# EAGLE schematic 001000-005 (EAGLE 9.5.0), part 1 of 2

## Sheet 1 of 6
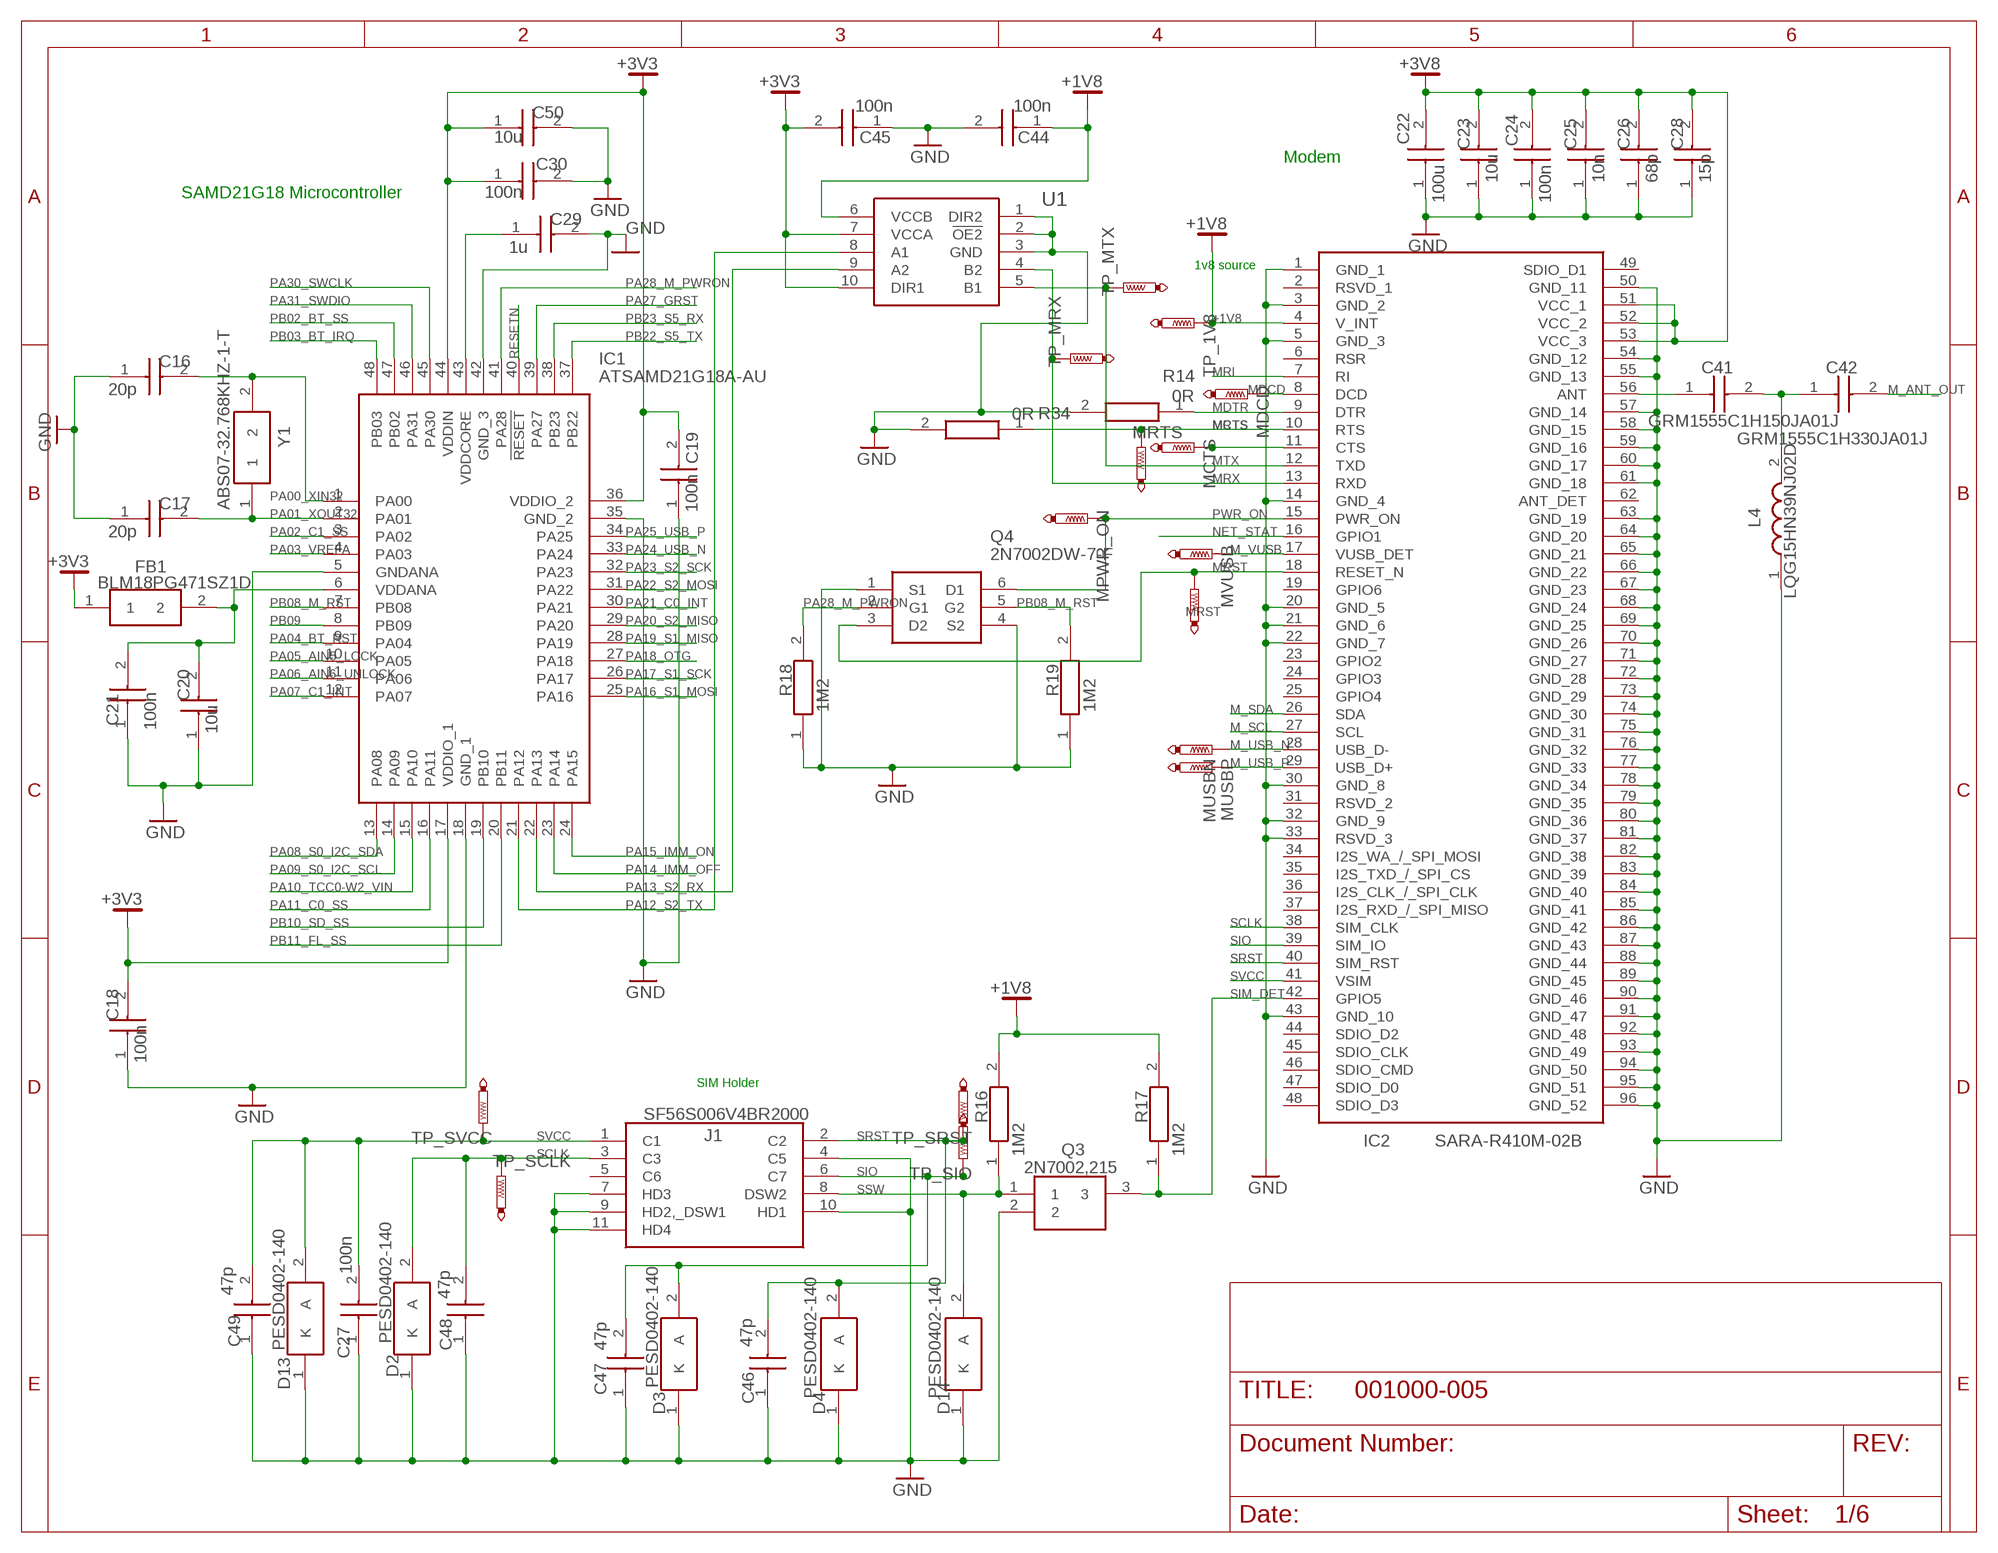
[diagram p0: schematic, sheet 1]

### Parts
C16  20p  GJM1555C1H200GB01D  [CAPC1005X55N]
C17  20p  GJM1555C1H200GB01D  [CAPC1005X55N]
C18  100n  GCM155R71C104KA55J  [CAPC1005X55N]
C19  100n  GCM155R71C104KA55J  [CAPC1005X55N]
C20  10u  GRM188R60J106KE47D  [CAPC1608X90N]
C21  100n  GCM155R71C104KA55J  [CAPC1005X55N]
C22  100u  GRM31CD80J107ME39K  [CAPC3216X180N]
C23  10u  GRM188R60J106KE47D  [CAPC1608X90N]
C24  100n  GCM155R71C104KA55J  [CAPC1005X55N]
C25  10n  GCM155R71H103KA55D  [CAPC1005X55N]
C26  68p  GCM1555C1H680JA16D  [CAPC1005X55N]
C27  100n  GCM155R71C104KA55J  [CAPC1005X55N]
C28  15p  GCM1555C1H150JA16D  [CAPC1005X55N]
C29  1u  GRM155R61C105MA12D  [CAPC1005X55N]
C30  100n  GCM155R71C104KA55J  [CAPC1005X55N]
C41  GRM1555C1H150JA01J  [CAPC1005X55N]
C42  GRM1555C1H330JA01J  [CAPC1005X55N]
C44  100n  GCM155R71C104KA55J  [CAPC1005X55N]
C45  100n  GCM155R71C104KA55J  [CAPC1005X55N]
C46  47p  GRM1555C1H470JA01D  [CAPC1005X55N]
C47  47p  GRM1555C1H470JA01D  [CAPC1005X55N]
C48  47p  GRM1555C1H470JA01D  [CAPC1005X55N]
C49  47p  GRM1555C1H470JA01D  [CAPC1005X55N]
C50  10u  GRM188R60J106KE47D  [CAPC1608X90N]
D2  PESD0402-140  [DIONC1005X43N]
D3  PESD0402-140  [DIONC1005X43N]
D4  PESD0402-140  [DIONC1005X43N]
D13  PESD0402-140  [DIONC1005X43N]
D14  PESD0402-140  [DIONC1005X43N]
FB1  BLM18PG471SZ1D  [BEADC1608X95N]
IC1  ATSAMD21G18A-AU  [QFP50P900X900X120-48N]
IC2  SARA-R410M-02B  [SARA-U201-03B]
J1  SF56S006V4BR2000  [SF56S006V4BR2000]
L4  LQG15HN39NJ02D  [INDC1005X55N]
MCTS  PTR1TP06R  [TP06R]
MDCD  PTR1TP06R  [TP06R]
MPWR_ON  PTR1TP06R  [TP06R]
MRST  PTR1TP06R  [TP06R]
MRTS  PTR1TP06R  [TP06R]
MUSBN  PTR1TP06R  [TP06R]
MUSBP  PTR1TP06R  [TP06R]
MVUSB  PTR1TP06R  [TP06R]
Q3  2N7002,215  [SOT95P230X110-3N]
Q4  2N7002DW-7-F  [SOT65P210X100-6N]
R14  0R  RMCF0402ZT0R00  [RESC1005X40N]
R16  1M2  CRCW04021M20FKED  [RESC1005X40N]
R17  1M2  CRCW04021M20FKED  [RESC1005X40N]
R18  1M2  CRCW04021M20FKED  [RESC1005X40N]
R19  1M2  CRCW04021M20FKED  [RESC1005X40N]
R34  0R  RMCF0402ZT0R00  [RESC1005X40N]
TP_1V8  PTR1TP06R  [TP06R]
TP_MRX  PTR1TP06R  [TP06R]
TP_MTX  PTR1TP06R  [TP06R]
TP_SCLK  PTR1TP06R  [TP06R]
TP_SIO  PTR1TP06R  [TP06R]
TP_SRST  PTR1TP06R  [TP06R]
TP_SVCC  PTR1TP06R  [TP06R]
U1  SN74AVC2T245RSWR  [RSW(RPUQFNN10)]
Y1  ABS07-32.768KHZ-1-T  [ABS0716632768KHZT]

### Nets
+1V8 [pwr/gnd]: C44.1 IC2.4(V_INT) R16.2 R17.2 TP_1V8.TP U1.6(VCCB)
+3V3 [pwr/gnd]: C18.2 C19.2 C30.1 C45.2 C50.1 FB1.1 IC1.17(VDDIO_1) IC1.36(VDDIO_2) IC1.44(VDDIN) U1.7(VCCA) U1.10(DIR1) ; also sheet 2,3,4,5,6
+3V8 [pwr/gnd]: C22.2 C23.2 C24.2 C25.2 C26.2 C28.2 IC2.51(VCC_1) IC2.52(VCC_2) IC2.53(VCC_3) ; also sheet 2,5
GND [pwr/gnd]: C16.1 C17.1 C18.1 C19.1 C20.1 C21.1 C22.1 C23.1 C24.1 C25.1 C26.1 C27.1 C28.1 C29.2 C30.2 C44.2 C45.1 C46.1 C47.1 C48.1 C49.1 C50.2 D2.1(K) D3.1(K) D4.1(K) D13.1(K) D14.1(K) IC1.5(GNDANA) IC1.18(GND_1) IC1.35(GND_2) IC1.42(GND_3) IC2.1(GND_1) IC2.3(GND_2) IC2.5(GND_3) IC2.14(GND_4) IC2.20(GND_5) IC2.21(GND_6) IC2.22(GND_7) IC2.30(GND_8) IC2.32(GND_9) IC2.33(RSVD_3) IC2.43(GND_10) IC2.50(GND_11) IC2.54(GND_12) IC2.55(GND_13) IC2.57(GND_14) IC2.58(GND_15) IC2.59(GND_16) IC2.60(GND_17) IC2.61(GND_18) IC2.63(GND_19) IC2.64(GND_20) IC2.65(GND_21) IC2.66(GND_22) IC2.67(GND_23) IC2.68(GND_24) IC2.69(GND_25) IC2.70(GND_26) IC2.71(GND_27) IC2.72(GND_28) IC2.73(GND_29) IC2.74(GND_30) IC2.75(GND_31) IC2.76(GND_32) IC2.77(GND_33) IC2.78(GND_34) IC2.79(GND_35) IC2.80(GND_36) IC2.81(GND_37) IC2.82(GND_38) IC2.83(GND_39) IC2.84(GND_40) IC2.85(GND_41) IC2.86(GND_42) IC2.87(GND_43) IC2.88(GND_44) IC2.89(GND_45) IC2.90(GND_46) IC2.91(GND_47) IC2.92(GND_48) IC2.93(GND_49) IC2.94(GND_50) IC2.95(GND_51) IC2.96(GND_52) J1.4(C5) J1.7(HD3) J1.9(HD2,_DSW1) J1.10(HD1) J1.11(HD4) L4.1 Q3.2 Q4.1(S1) Q4.4(S2) R14.2 R18.1 R19.1 R34.2 U1.1(DIR2) U1.2(!OE2) U1.3(GND) ; also sheet 2,3,4,5,6
M_ANT_OUT [ant_wide]: C42.2 ; also sheet 6
M_SCL [signal]: IC2.27(SCL) ; also sheet 5
M_SDA [signal]: IC2.26(SDA) ; also sheet 5
M_USB_N [signal]: IC2.28(USB_D-) MUSBN.TP
M_USB_P [signal]: IC2.29(USB_D+) MUSBP.TP
M_VUSB [signal]: IC2.17(VUSB_DET) MVUSB.TP
MCTS: IC2.11(CTS) MCTS.TP
MDCD: IC2.8(DCD) MDCD.TP
MDTR [signal]: IC2.9(DTR) R14.1
MRI [signal]: IC2.7(RI)
MRST [signal]: IC2.18(RESET_N) MRST.TP Q4.3(D2)
MRTS: IC2.10(RTS) MRTS.TP R34.1
MRX [signal]: IC2.13(RXD) TP_MRX.TP U1.4(B2)
MTX [signal]: IC2.12(TXD) TP_MTX.TP U1.5(B1)
N$1: C20.2 C21.2 FB1.2 IC1.6(VDDANA)
N$2: C41.1 IC2.56(ANT)
N$26: C29.1 IC1.43(VDDCORE)
N$43: C41.2 C42.1 L4.2
NET_STAT: IC2.16(GPIO1) ; also sheet 5
PA00_XIN32 [signal]: C16.2 IC1.1(PA00) Y1.2
PA01_XOUT32 [signal]: C17.2 IC1.2(PA01) Y1.1
PA02_C1_SS [signal]: IC1.3(PA02) ; also sheet 4
PA03_VREFA [signal]: IC1.4(PA03)
PA04_BT_RST [signal]: IC1.9(PA04) ; also sheet 3
PA05_AIN5_LOCK [signal]: IC1.10(PA05) ; also sheet 3
PA06_AIN6_UNLOCK [signal]: IC1.11(PA06) ; also sheet 3
PA07_C1_INT [signal]: IC1.12(PA07) ; also sheet 4
PA08_S0_I2C_SDA [signal]: IC1.13(PA08) ; also sheet 3,5
PA09_S0_I2C_SCL [signal]: IC1.14(PA09) ; also sheet 3,5
PA10_TCC0-W2_VIN [signal]: IC1.15(PA10) ; also sheet 3
PA11_C0_SS [signal]: IC1.16(PA11) ; also sheet 4
PA12_S2_TX [signal]: IC1.21(PA12) U1.8(A1)
PA13_S2_RX [signal]: IC1.22(PA13) U1.9(A2)
PA14_IMM_OFF [signal]: IC1.23(PA14) ; also sheet 3
PA15_IMM_ON [signal]: IC1.24(PA15) ; also sheet 3
PA16_S1_MOSI [signal]: IC1.25(PA16) ; also sheet 3,4
PA17_S1_SCK [signal]: IC1.26(PA17) ; also sheet 3,4
PA18_OTG [signal]: IC1.27(PA18) ; also sheet 6
PA19_S1_MISO [signal]: IC1.28(PA19) ; also sheet 3,4
PA20_S2_MISO [signal]: IC1.29(PA20) ; also sheet 3
PA21_C0_INT [signal]: IC1.30(PA21) ; also sheet 4
PA22_S2_MOSI [signal]: IC1.31(PA22) ; also sheet 3
PA23_S2_SCK [signal]: IC1.32(PA23) ; also sheet 3
PA24_USB_N [signal]: IC1.33(PA24) ; also sheet 6
PA25_USB_P [signal]: IC1.34(PA25) ; also sheet 6
PA27_GRST [signal]: IC1.39(PA27) ; also sheet 5
PA28_M_PWRON [signal]: IC1.41(PA28) Q4.2(G1) R18.2
PA30_SWCLK [signal]: IC1.45(PA30) ; also sheet 6
PA31_SWDIO [signal]: IC1.46(PA31) ; also sheet 6
PB02_BT_SS [signal]: IC1.47(PB02) ; also sheet 3
PB03_BT_IRQ [signal]: IC1.48(PB03) ; also sheet 3
PB08_M_RST [signal]: IC1.7(PB08) Q4.5(G2) R19.2
PB09 [signal]: IC1.8(PB09) ; also sheet 5
PB10_SD_SS [signal]: IC1.19(PB10) ; also sheet 3
PB11_FL_SS [signal]: IC1.20(PB11) ; also sheet 3
PB22_S5_TX [signal]: IC1.37(PB22) ; also sheet 5
PB23_S5_RX [signal]: IC1.38(PB23) ; also sheet 5
PWR_ON: IC2.15(PWR_ON) MPWR_ON.TP Q4.6(D1)
RESETN: IC1.40(!RESET) ; also sheet 6
SCLK [signal]: C48.2 D2.2(A) IC2.38(SIM_CLK) J1.3(C3) TP_SCLK.TP
SIM_DET [signal]: IC2.42(GPIO5) Q3.3 R17.1
SIO [signal]: C47.2 D3.2(A) IC2.39(SIM_IO) J1.6(C7) TP_SIO.TP
SRST [signal]: C46.2 D4.2(A) IC2.40(SIM_RST) J1.2(C2) TP_SRST.TP
SSW [signal]: D14.2(A) J1.8(DSW2) Q3.1 R16.1
SVCC [signal]: C27.2 C49.2 D13.2(A) IC2.41(VSIM) J1.1(C1) TP_SVCC.TP
Unconnected: IC2.2(RSVD_1) IC2.6(RSR) IC2.19(GPIO6) IC2.23(GPIO2) IC2.24(GPIO3) IC2.25(GPIO4) IC2.31(RSVD_2) IC2.34(I2S_WA_/_SPI_MOSI) IC2.35(I2S_TXD_/_SPI_CS) IC2.36(I2S_CLK_/_SPI_CLK) IC2.37(I2S_RXD_/_SPI_MISO) IC2.44(SDIO_D2) IC2.45(SDIO_CLK) IC2.46(SDIO_CMD) IC2.47(SDIO_D0) IC2.48(SDIO_D3) IC2.49(SDIO_D1) IC2.62(ANT_DET) J1.5(C6)

### Notes on the sheet
- Modem
- SAMD21G18 Microcontroller
- 1v8 source
- SIM Holder

## Sheet 2 of 6
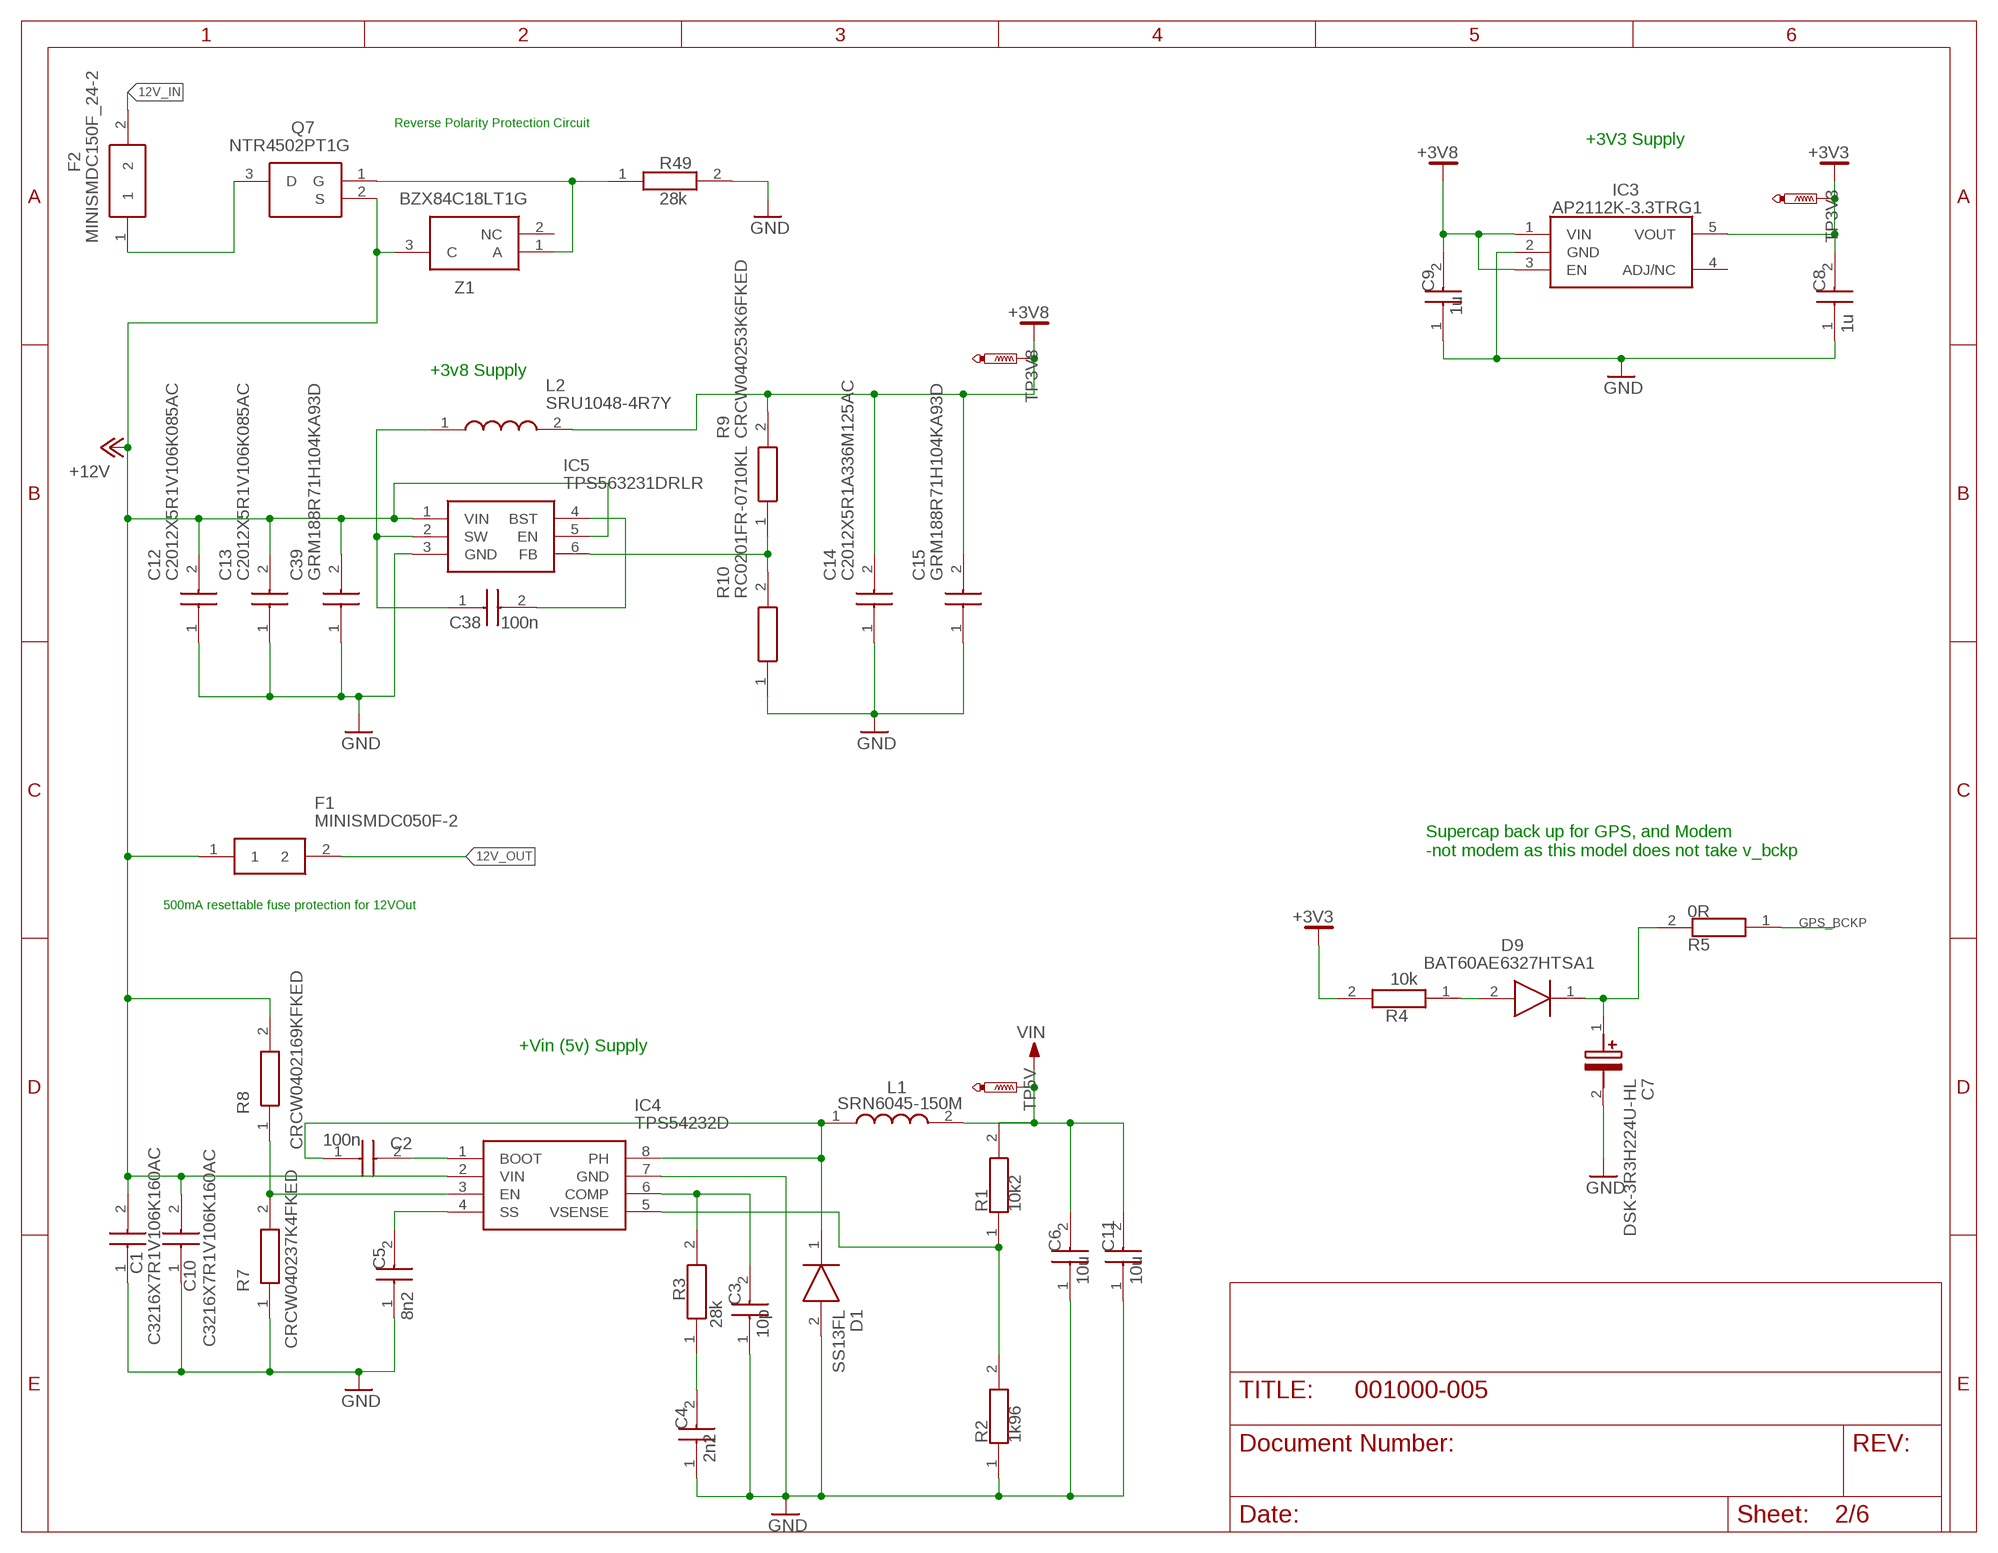
[diagram p1: schematic, sheet 2]

### Parts
C1  C3216X7R1V106K160AC  [CAPC3216X180N]
C2  100n  GCM155R71C104KA55J  [CAPC1005X55N]
C3  10p  GCM1555C1H100JA16D  [CAPC1005X55N]
C4  2n2  GRM155R71H222KA01D  [CAPC1005X55N]
C5  8n2  GRM155R71C822KA01D  [CAPC1005X55N]
C6  10u  GRM21BC81C106KE15L  [CAPC2012X145N]
C7  DSK-3R3H224U-HL  [DSK-414_HL]
C8  1u  GRM155R61C105MA12D  [CAPC1005X55N]
C9  1u  GRM155R61C105MA12D  [CAPC1005X55N]
C10  C3216X7R1V106K160AC  [CAPC3216X180N]
C11  10u  GRM21BC81C106KE15L  [CAPC2012X145N]
C12  C2012X5R1V106K085AC  [CAPC2012X100N]
C13  C2012X5R1V106K085AC  [CAPC2012X100N]
C14  C2012X5R1A336M125AC  [CAPC2012X145N]
C15  GRM188R71H104KA93D  [CAPC1608X90N]
C38  100n  GCM155R71C104KA55J  [CAPC1005X55N]
C39  GRM188R71H104KA93D  [CAPC1608X90N]
D1  SS13FL  [SODFL3617X108N]
D9  BAT60AE6327HTSA1  [SOD2513X110N]
F1  MINISMDC050F-2  [FUSC4632X62N]
F2  MINISMDC150F_24-2  [FUSC4632X194N]
IC3  AP2112K-3.3TRG1  [SOT95P282X130-5N]
IC4  TPS54232D  [SOIC127P600X175-8N]
IC5  TPS563231DRLR  [SOTFL50P160X60-6N]
L1  SRN6045-150M  [SRN6045_1]
L2  SRU1048-4R7Y  [SRU10484R7Y]
Q7  NTR4502PT1G  [SOT96P237X111-3N]
R1  10k2  CRCW040210K2FKED  [RESC1005X40N]
R2  1k96  CRCW04021K96FKED  [RESC1005X40N]
R3  28k  CRCW040228K0FKED  [RESC1005X40N]
R4  10k  RNCP0603FTD10K0  [RESC1508X50N]
R5  0R  RMCF0402ZT0R00  [RESC1005X40N]
R7  CRCW040237K4FKED  [RESC1005X40N]
R8  CRCW0402169KFKED  [RESC1005X40N]
R9  CRCW040253K6FKED  [RESC1005X40N]
R10  RC0201FR-0710KL  [RESC0603X26N]
R49  28k  CRCW040228K0FKED  [RESC1005X40N]
TP3V3  PTR1TP06R  [TP06R]
TP3V8  PTR1TP06R  [TP06R]
TP5V  PTR1TP06R  [TP06R]
Z1  BZX84C18LT1G  [SOT95P237X111-3N]

### Nets
12V_IN: F2.2 ; also sheet 6
12V_OUT: F1.2 ; also sheet 6
+3V3 [pwr/gnd]: C8.2 IC3.5(VOUT) R4.2 TP3V3.TP ; also sheet 1,3,4,5,6
+3V8 [pwr/gnd]: C9.2 C14.2 C15.2 IC3.1(VIN) IC3.3(EN) L2.2 R9.2 TP3V8.TP ; also sheet 1,5
+12V: C1.2 C10.2 C12.2 C13.2 C39.2 F1.1 IC4.2(VIN) IC5.1(VIN) IC5.5(EN) Q7.2(S) R8.2 Z1.3(C) ; also sheet 3
GND [pwr/gnd]: C1.1 C3.1 C4.1 C5.1 C6.1 C7.2(+) C8.1 C9.1 C10.1 C11.1 C12.1 C13.1 C14.1 C15.1 C39.1 D1.2(A) IC3.2(GND) IC4.7(GND) IC5.3(GND) R2.1 R7.1 R10.1 R49.2 ; also sheet 1,3,4,5,6
GPS_BCKP: R5.1 ; also sheet 5
N$5: C2.2 IC4.1(BOOT)
N$6: C2.1 D1.1(K) IC4.8(PH) L1.1
N$7: C3.2 IC4.6(COMP) R3.2
N$8: C4.2 R3.1
N$9: IC4.5(VSENSE) R1.1 R2.2
N$10: D9.2(A) R4.1
N$11: C5.2 IC4.4(SS)
N$12: C7.1(-) D9.1(K) R5.2
N$13: IC4.3(EN) R7.2 R8.1
N$16: C38.1 IC5.2(SW) L2.1
N$18: IC5.6(FB) R9.1 R10.2
N$20: C38.2 IC5.4(BST)
N$25: F2.1 Q7.3(D)
N$31: Q7.1(G) R49.1 Z1.1(A)
VIN: C6.2 C11.2 L1.2 R1.2 TP5V.TP ; also sheet 4
Unconnected: IC3.4(ADJ/NC) Z1.2(NC)

### Notes on the sheet
- Reverse Polarity Protection Circuit
- +3V3 Supply
- +3v8 Supply
- Supercap back up for GPS, and Modem
  -not modem as this model does not take v_bckp
- 500mA resettable fuse protection for 12VOut
- +Vin (5v) Supply

## Sheet 3 of 6
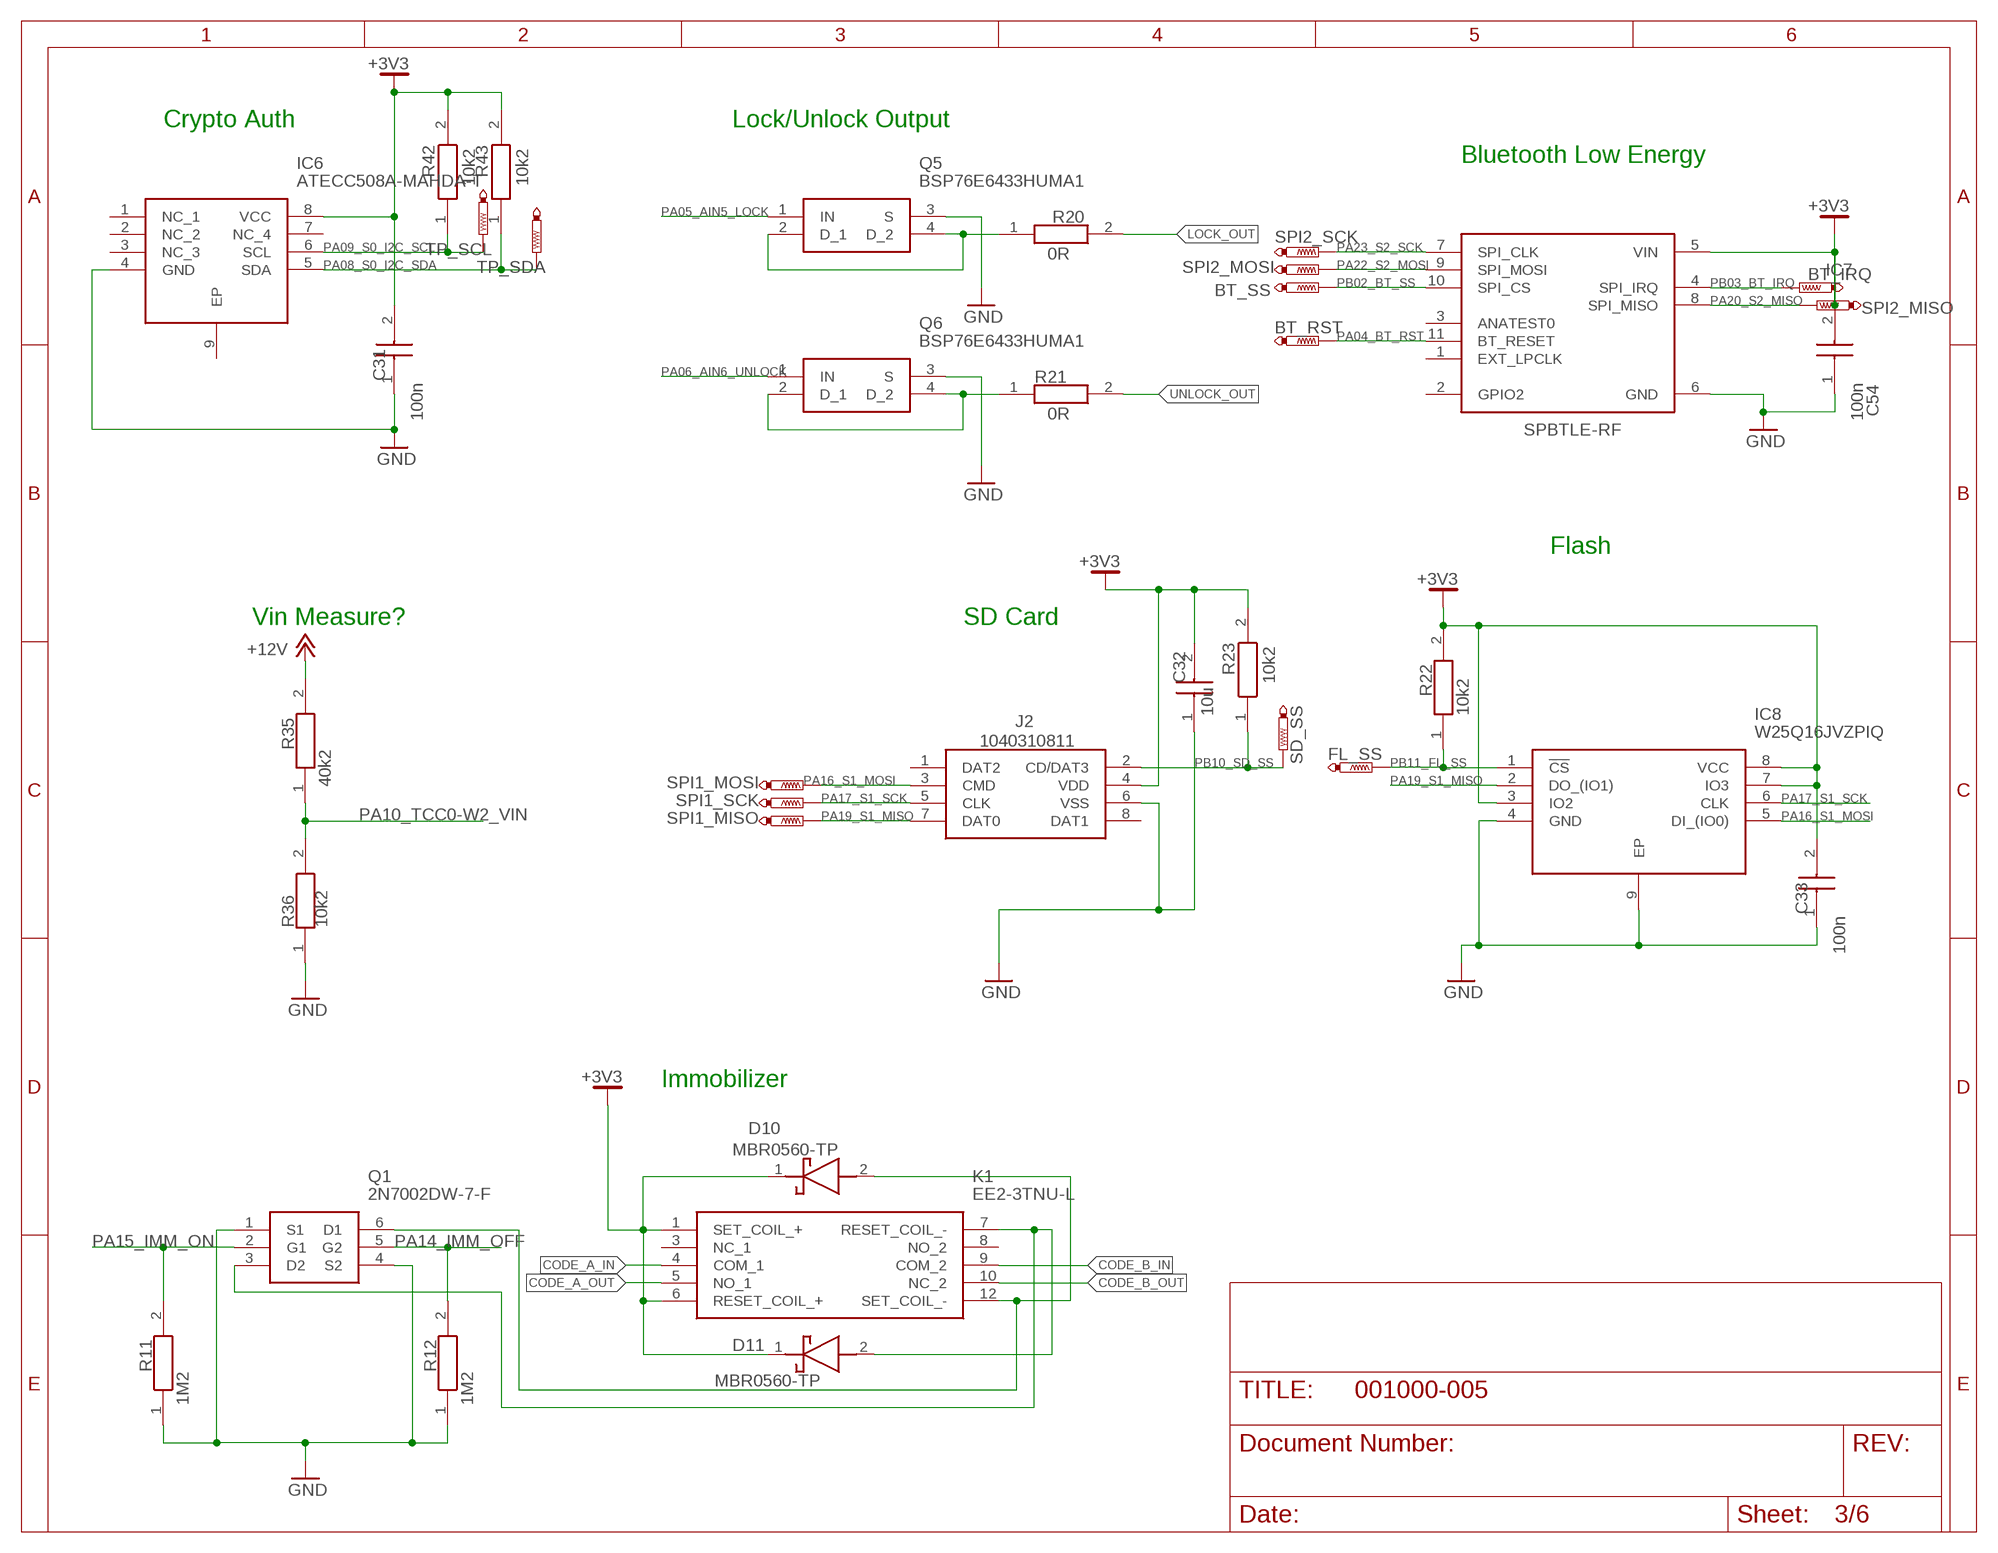
[diagram p2: schematic, sheet 3]

### Parts
BT_IRQ  PTR1TP06R  [TP06R]
BT_RST  PTR1TP06R  [TP06R]
BT_SS  PTR1TP06R  [TP06R]
C31  100n  GCM155R71C104KA55J  [CAPC1005X55N]
C32  10u  GRM155C80J106ME11D  [CAPC1005X55N]
C33  100n  GCM155R71C104KA55J  [CAPC1005X55N]
C54  100n  GCM155R71C104KA55J  [CAPC1005X55N]
D10  MBR0560-TP  [SOD3716X135N]
D11  MBR0560-TP  [SOD3716X135N]
FL_SS  PTR1TP06R  [TP06R]
IC6  ATECC508A-MAHDA-T  [SON50P300X200X60-9N]
IC7  SPBTLE-RF  [XCVR_SPBTLE-RF]
IC8  W25Q16JVZPIQ  [SON127P600X500X80-9N]
J2  1040310811  [1040310811]
K1  EE2-3TNU-L  [EE25TNU]
Q1  2N7002DW-7-F  [SOT65P210X100-6N]
Q5  BSP76E6433HUMA1  [SOT230P700X170-4N]
Q6  BSP76E6433HUMA1  [SOT230P700X170-4N]
R11  1M2  CRCW04021M20FKED  [RESC1005X40N]
R12  1M2  CRCW04021M20FKED  [RESC1005X40N]
R20  0R  CRG1206ZR  [RESC3116X65N]
R21  0R  CRG1206ZR  [RESC3116X65N]
R22  10k2  CRCW040210K2FKED  [RESC1005X40N]
R23  10k2  CRCW040210K2FKED  [RESC1005X40N]
R35  40k2  CRCW040240K2FKED  [RESC1005X40N]
R36  10k2  CRCW040210K2FKED  [RESC1005X40N]
R42  10k2  CRCW040210K2FKED  [RESC1005X40N]
R43  10k2  CRCW040210K2FKED  [RESC1005X40N]
SD_SS  PTR1TP06R  [TP06R]
SPI1_MISO  PTR1TP06R  [TP06R]
SPI1_MOSI  PTR1TP06R  [TP06R]
SPI1_SCK  PTR1TP06R  [TP06R]
SPI2_MISO  PTR1TP06R  [TP06R]
SPI2_MOSI  PTR1TP06R  [TP06R]
SPI2_SCK  PTR1TP06R  [TP06R]
TP_SCL  PTR1TP06R  [TP06R]
TP_SDA  PTR1TP06R  [TP06R]

### Nets
+3V3 [pwr/gnd]: C31.2 C32.2 C33.2 C54.2 D10.1(K) D11.1(K) IC6.8(VCC) IC7.5(VIN) IC8.3(IO2) IC8.7(IO3) IC8.8(VCC) J2.4(VDD) K1.1(SET_COIL_+) K1.6(RESET_COIL_+) R22.2 R23.2 R42.2 R43.2 ; also sheet 1,2,4,5,6
+12V: R35.2 ; also sheet 2
CODE_A_IN [signal]: K1.4(COM_1) ; also sheet 6
CODE_A_OUT [signal]: K1.5(NO_1) ; also sheet 6
CODE_B_IN [signal]: K1.9(COM_2) ; also sheet 6
CODE_B_OUT [signal]: K1.10(NC_2) ; also sheet 6
GND [pwr/gnd]: C31.1 C32.1 C33.1 C54.1 IC6.4(GND) IC7.6(GND) IC8.4(GND) IC8.9(EP) J2.6(VSS) Q1.1(S1) Q1.4(S2) Q5.3(S) Q6.3(S) R11.1 R12.1 R36.1 ; also sheet 1,2,4,5,6
LOCK_OUT: R20.2 ; also sheet 6
N$15: D11.2(A) K1.7(RESET_COIL_-) Q1.3(D2)
N$19: D10.2(A) K1.12(SET_COIL_-) Q1.6(D1)
N$28: Q6.2(D_1) Q6.4(D_2) R21.1
N$29: Q5.2(D_1) Q5.4(D_2) R20.1
PA04_BT_RST [signal]: BT_RST.TP IC7.11(BT_RESET) ; also sheet 1
PA05_AIN5_LOCK [signal]: Q5.1(IN) ; also sheet 1
PA06_AIN6_UNLOCK [signal]: Q6.1(IN) ; also sheet 1
PA08_S0_I2C_SDA [signal]: IC6.5(SDA) R43.1 TP_SDA.TP ; also sheet 1,5
PA09_S0_I2C_SCL [signal]: IC6.6(SCL) R42.1 TP_SCL.TP ; also sheet 1,5
PA10_TCC0-W2_VIN [signal]: R35.1 R36.2 ; also sheet 1
PA14_IMM_OFF [signal]: Q1.5(G2) R12.2 ; also sheet 1
PA15_IMM_ON [signal]: Q1.2(G1) R11.2 ; also sheet 1
PA16_S1_MOSI [signal]: IC8.5(DI_(IO0)) J2.3(CMD) SPI1_MOSI.TP ; also sheet 1,4
PA17_S1_SCK [signal]: IC8.6(CLK) J2.5(CLK) SPI1_SCK.TP ; also sheet 1,4
PA19_S1_MISO [signal]: IC8.2(DO_(IO1)) J2.7(DAT0) SPI1_MISO.TP ; also sheet 1,4
PA20_S2_MISO [signal]: IC7.8(SPI_MISO) SPI2_MISO.TP ; also sheet 1
PA22_S2_MOSI [signal]: IC7.9(SPI_MOSI) SPI2_MOSI.TP ; also sheet 1
PA23_S2_SCK [signal]: IC7.7(SPI_CLK) SPI2_SCK.TP ; also sheet 1
PB02_BT_SS [signal]: BT_SS.TP IC7.10(SPI_CS) ; also sheet 1
PB03_BT_IRQ [signal]: BT_IRQ.TP IC7.4(SPI_IRQ) ; also sheet 1
PB10_SD_SS [signal]: J2.2(CD/DAT3) R23.1 SD_SS.TP ; also sheet 1
PB11_FL_SS [signal]: FL_SS.TP IC8.1(!CS) R22.1 ; also sheet 1
UNLOCK_OUT: R21.2 ; also sheet 6
Unconnected: IC6.1(NC_1) IC6.2(NC_2) IC6.3(NC_3) IC6.7(NC_4) IC6.9(EP) IC7.1(EXT_LPCLK) IC7.2(GPIO2) IC7.3(ANATEST0) J2.1(DAT2) J2.8(DAT1) K1.3(NC_1) K1.8(NO_2)

### Notes on the sheet
- Crypto Auth | Lock/Unlock Output
- Bluetooth Low Energy
- Flash
- Vin Measure? | SD Card
- Immobilizer

## Sheet 4 of 6
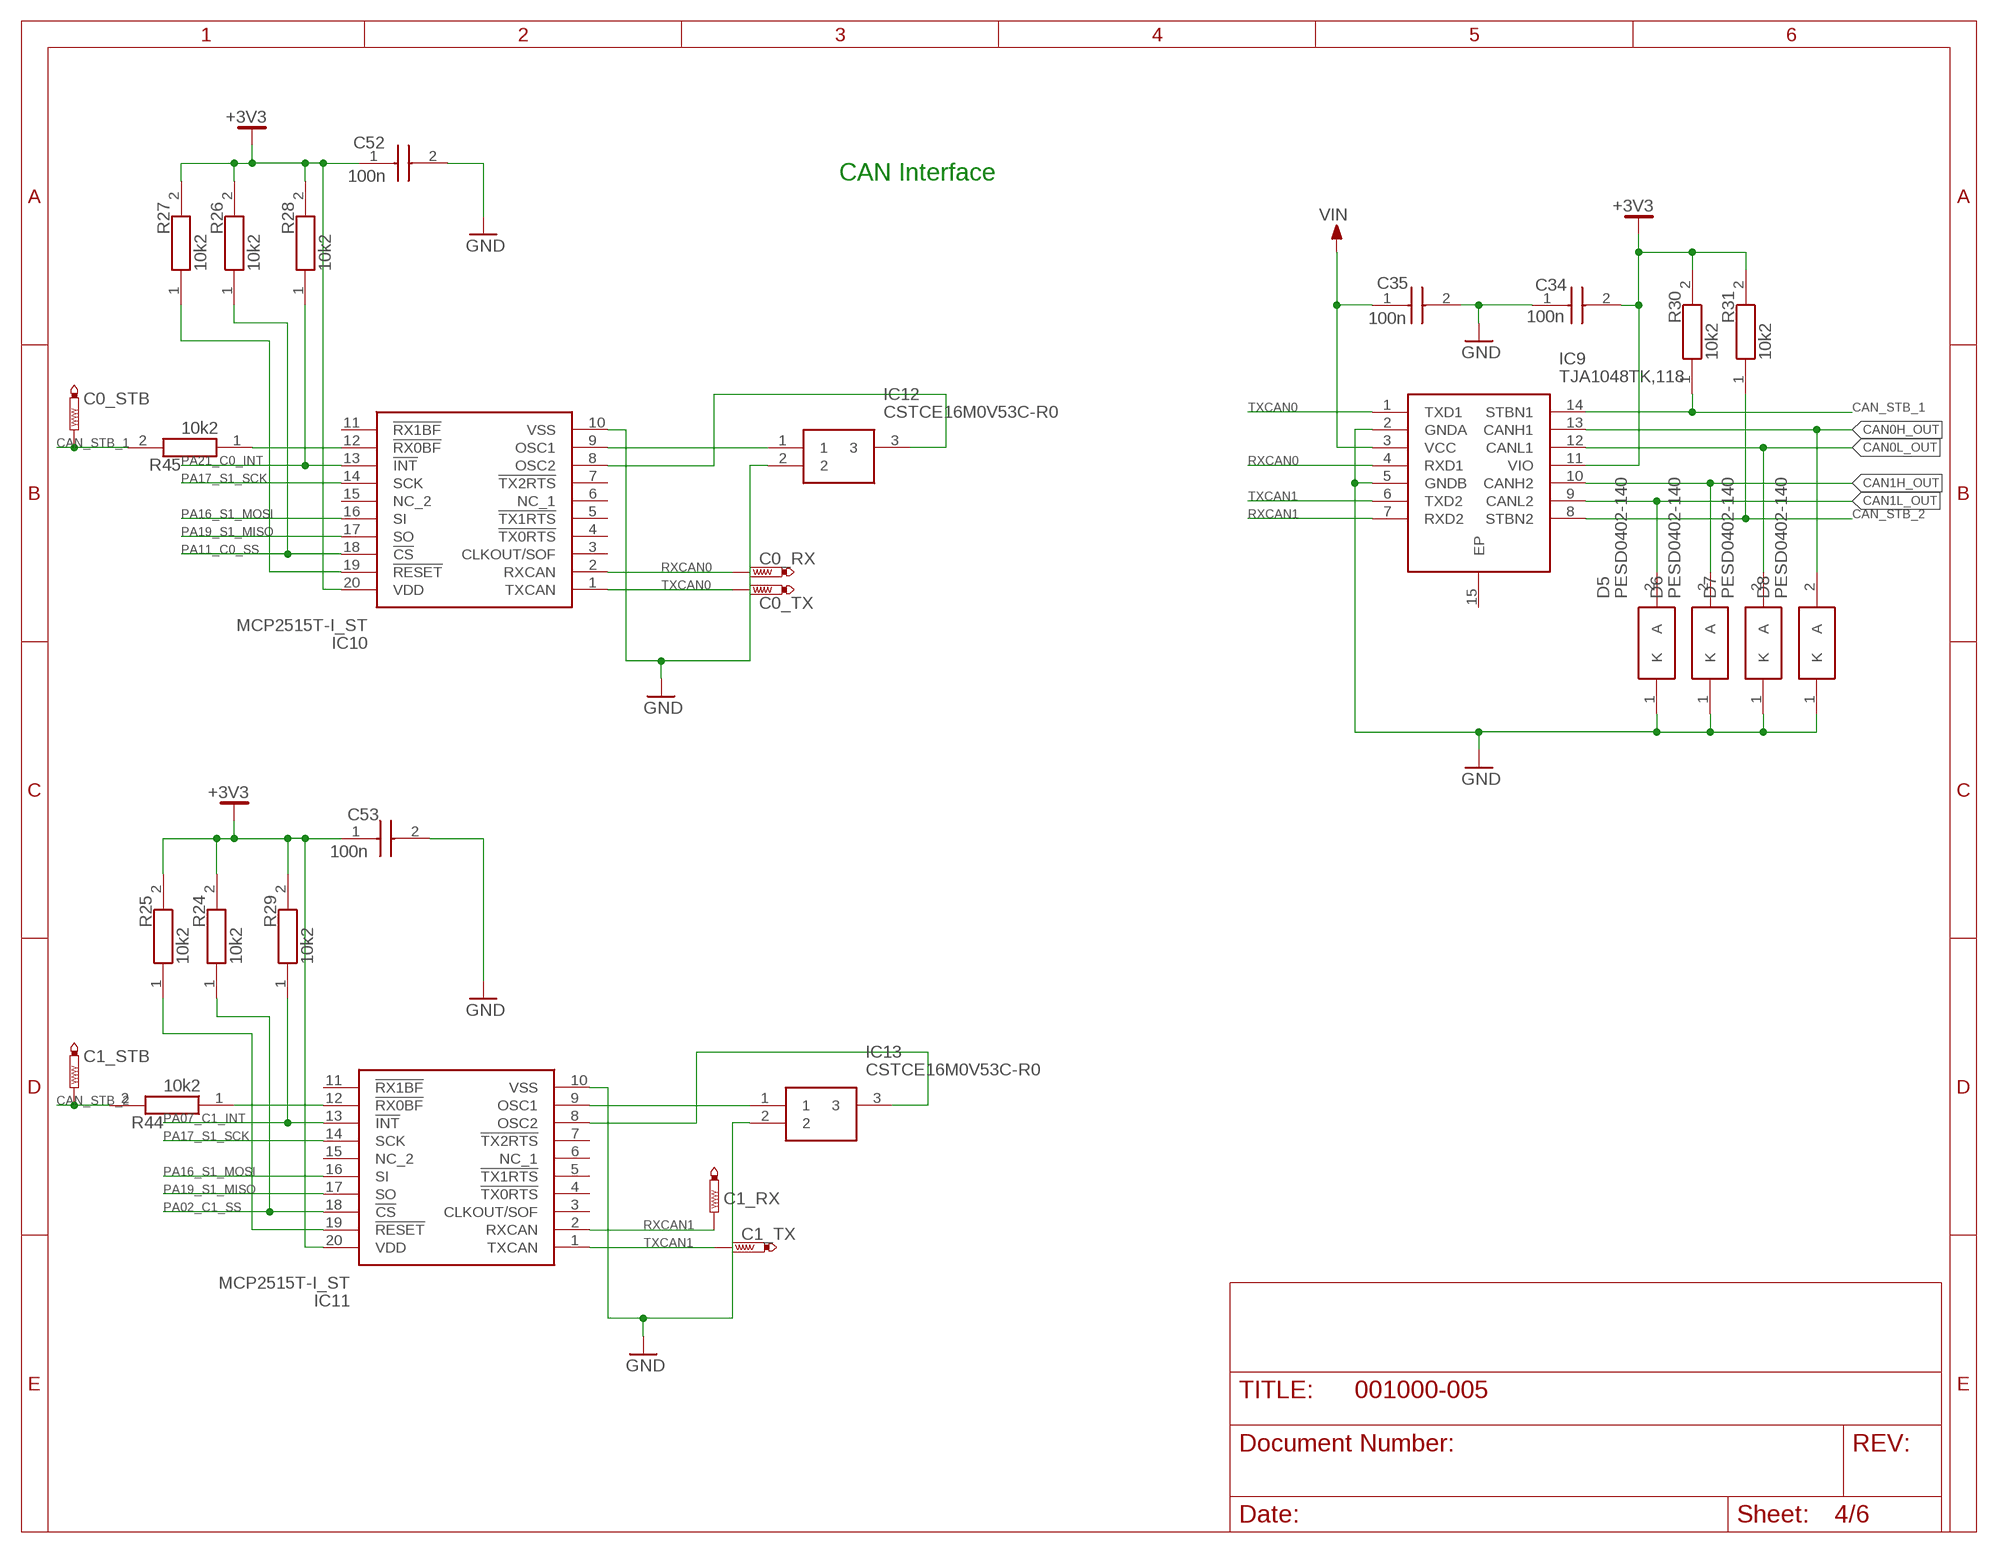
[diagram p3: schematic, sheet 4]

### Parts
C0_RX  PTR1TP06R  [TP06R]
C0_STB  PTR1TP06R  [TP06R]
C0_TX  PTR1TP06R  [TP06R]
C1_RX  PTR1TP06R  [TP06R]
C1_STB  PTR1TP06R  [TP06R]
C1_TX  PTR1TP06R  [TP06R]
C34  100n  GCM155R71C104KA55J  [CAPC1005X55N]
C35  100n  GCM155R71C104KA55J  [CAPC1005X55N]
C52  100n  GCM155R71C104KA55J  [CAPC1005X55N]
C53  100n  GCM155R71C104KA55J  [CAPC1005X55N]
D5  PESD0402-140  [DIONC1005X43N]
D6  PESD0402-140  [DIONC1005X43N]
D7  PESD0402-140  [DIONC1005X43N]
D8  PESD0402-140  [DIONC1005X43N]
IC9  TJA1048TK,118  [SON65P300X450X100-15N]
IC10  MCP2515T-I_ST  [SOP65P640X120-20N]
IC11  MCP2515T-I_ST  [SOP65P640X120-20N]
IC12  CSTCE16M0V53C-R0  [CSTCE16M0V53CR0]
IC13  CSTCE16M0V53C-R0  [CSTCE16M0V53CR0]
R24  10k2  CRCW040210K2FKED  [RESC1005X40N]
R25  10k2  CRCW040210K2FKED  [RESC1005X40N]
R26  10k2  CRCW040210K2FKED  [RESC1005X40N]
R27  10k2  CRCW040210K2FKED  [RESC1005X40N]
R28  10k2  CRCW040210K2FKED  [RESC1005X40N]
R29  10k2  CRCW040210K2FKED  [RESC1005X40N]
R30  10k2  CRCW040210K2FKED  [RESC1005X40N]
R31  10k2  CRCW040210K2FKED  [RESC1005X40N]
R44  10k2  CRCW040210K2FKED  [RESC1005X40N]
R45  10k2  CRCW040210K2FKED  [RESC1005X40N]

### Nets
+3V3 [pwr/gnd]: C34.2 C52.1 C53.1 IC9.11(VIO) IC10.20(VDD) IC11.20(VDD) R24.2 R25.2 R26.2 R27.2 R28.2 R29.2 R30.2 R31.2 ; also sheet 1,2,3,5,6
CAN0H_OUT: D8.2(A) IC9.13(CANH1) ; also sheet 6
CAN0L_OUT: D7.2(A) IC9.12(CANL1) ; also sheet 6
CAN1H_OUT: D6.2(A) IC9.10(CANH2) ; also sheet 6
CAN1L_OUT: D5.2(A) IC9.9(CANL2) ; also sheet 6
CAN_STB_1: C0_STB.TP IC9.14(STBN1) R30.1 R45.2
CAN_STB_2: C1_STB.TP IC9.8(STBN2) R31.1 R44.2
GND [pwr/gnd]: C34.1 C35.2 C52.2 C53.2 D5.1(K) D6.1(K) D7.1(K) D8.1(K) IC9.2(GNDA) IC9.5(GNDB) IC10.10(VSS) IC11.10(VSS) IC12.2 IC13.2 ; also sheet 1,2,3,5,6
N$14: IC11.12(!RX0BF) R44.1
N$17: IC10.12(!RX0BF) R45.1
N$27: IC10.9(OSC1) IC12.1
N$30: IC10.8(OSC2) IC12.3
N$32: IC11.9(OSC1) IC13.1
N$33: IC11.8(OSC2) IC13.3
N$39: IC11.19(!RESET) R25.1
N$42: IC10.19(!RESET) R27.1
PA02_C1_SS [signal]: IC11.18(!CS) R24.1 ; also sheet 1
PA07_C1_INT [signal]: IC11.13(!INT) R29.1 ; also sheet 1
PA11_C0_SS [signal]: IC10.18(!CS) R26.1 ; also sheet 1
PA16_S1_MOSI [signal]: IC10.16(SI) IC11.16(SI) ; also sheet 1,3
PA17_S1_SCK [signal]: IC10.14(SCK) IC11.14(SCK) ; also sheet 1,3
PA19_S1_MISO [signal]: IC10.17(SO) IC11.17(SO) ; also sheet 1,3
PA21_C0_INT [signal]: IC10.13(!INT) R28.1 ; also sheet 1
RXCAN0 [signal]: C0_RX.TP IC9.4(RXD1) IC10.2(RXCAN)
RXCAN1 [signal]: C1_RX.TP IC9.7(RXD2) IC11.2(RXCAN)
TXCAN0 [signal]: C0_TX.TP IC9.1(TXD1) IC10.1(TXCAN)
TXCAN1 [signal]: C1_TX.TP IC9.6(TXD2) IC11.1(TXCAN)
VIN: C35.1 IC9.3(VCC) ; also sheet 2
Unconnected: IC9.15(EP) IC10.3(CLKOUT/SOF) IC10.4(!TX0RTS) IC10.5(!TX1RTS) IC10.6(NC_1) IC10.7(!TX2RTS) IC10.11(!RX1BF) IC10.15(NC_2) IC11.3(CLKOUT/SOF) IC11.4(!TX0RTS) IC11.5(!TX1RTS) IC11.6(NC_1) IC11.7(!TX2RTS) IC11.11(!RX1BF) IC11.15(NC_2)

### Notes on the sheet
- CAN Interface

## Sheet 5 of 6
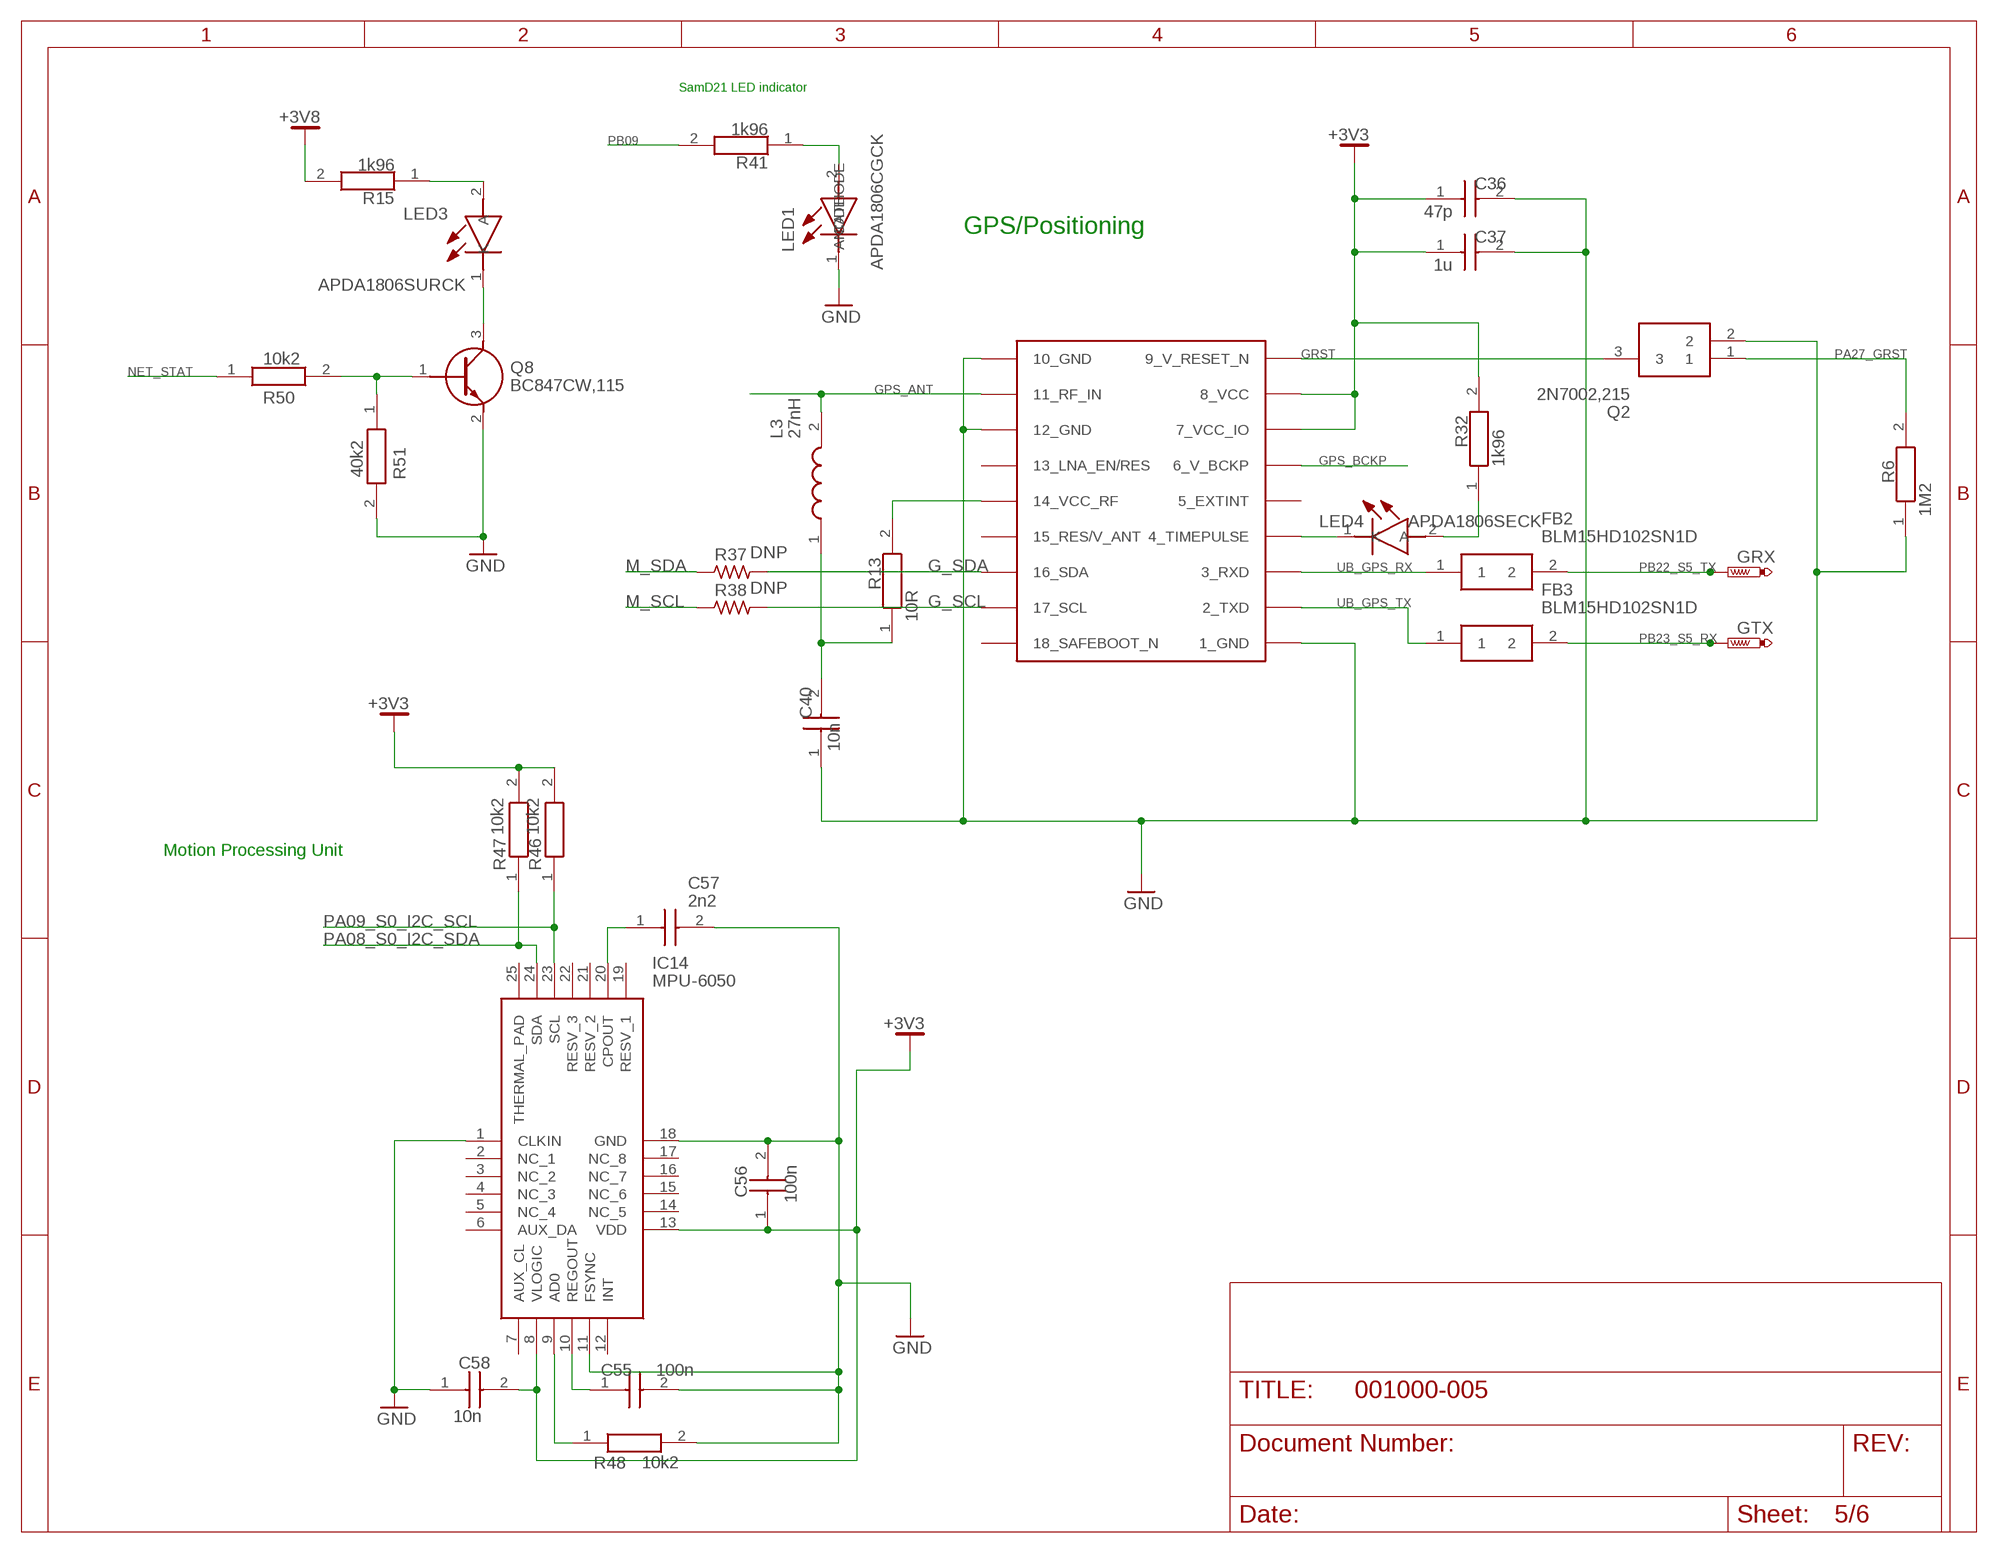
[diagram p4: schematic, sheet 5]

### Parts
C36  47p  GRM1555C1H470JA01D  [CAPC1005X55N]
C37  1u  GRT188C8YA105KE13D  [CAPC1608X90N]
C40  10n  GCM155R71H103KA55D  [CAPC1005X55N]
C55  100n  GCM155R71C104KA55J  [CAPC1005X55N]
C56  100n  GCM155R71C104KA55J  [CAPC1005X55N]
C57  2n2  GRM155R71H222KA01D  [CAPC1005X55N]
C58  10n  GCM155R71H103KA55D  [CAPC1005X55N]
FB2  BLM15HD102SN1D  [BEADC1005X55N]
FB3  BLM15HD102SN1D  [BEADC1005X55N]
GRX  PTR1TP06R  [TP06R]
GTX  PTR1TP06R  [TP06R]
IC14  MPU-6050  [QFN50P400X400X95-25N]
L3  27nH  L-14C27NJV4T  [INDC1608X95N]
LED1  APDA1806CGCK  [APDA1806CGCK]
LED3  APDA1806SURCK  [APDA1806SURCK]
LED4  APDA1806SECK  [APDA1806SECK]
Q2  2N7002,215  [SOT95P230X110-3N]
Q8  BC847CW,115  [SOT65P210X110-3N]
R6  1M2  CRCW04021M20FKED  [RESC1005X40N]
R13  10R  CRGCQ0402F10R  [RESC1005X35N]
R15  1k96  CRCW04021K96FKED  [RESC1005X40N]
R32  1k96  CRCW04021K96FKED  [RESC1005X40N]
R37  DNP  R_0402  [R0402]
R38  DNP  R_0402  [R0402]
R41  1k96  CRCW04021K96FKED  [RESC1005X40N]
R46  10k2  CRCW040210K2FKED  [RESC1005X40N]
R47  10k2  CRCW040210K2FKED  [RESC1005X40N]
R48  10k2  CRCW040210K2FKED  [RESC1005X40N]
R50  10k2  CRCW040210K2FKED  [RESC1005X40N]
R51  40k2  CRCW040240K2FKED  [RESC1005X40N]
U$1  MAX-M8  [MAX-M8]

### Nets
+3V3 [pwr/gnd]: C36.1 C37.1 C56.1 C58.2 IC14.8(VLOGIC) IC14.13(VDD) R32.2 R46.2 R47.2 U$1.7_VCC_IO U$1.8_VCC ; also sheet 1,2,3,4,6
+3V8 [pwr/gnd]: R15.2 ; also sheet 1,2
G_SCL [signal]: R38.2 U$1.17_SCL
G_SDA [signal]: R37.2 U$1.16_SDA
GND [pwr/gnd]: C36.2 C37.2 C40.1 C55.2 C56.2 C57.2 C58.1 IC14.1(CLKIN) IC14.11(FSYNC) IC14.18(GND) LED1.1(CATHODE) Q2.2 Q8.2(E) R6.1 R48.2 R51.2 U$1.1_GND U$1.10_GND U$1.12_GND ; also sheet 1,2,3,4,6
GPS_ANT [ant_wide]: L3.2 U$1.11_RF_IN ; also sheet 6
GPS_BCKP: U$1.6_V_BCKP ; also sheet 2
GRST [signal]: Q2.3 U$1.9_RESET_N(9_V_RESET_N)
M_SCL [signal]: R38.1 ; also sheet 1
M_SDA [signal]: R37.1 ; also sheet 1
MPU_AD0: IC14.9(AD0) R48.1
MPU_CPOUT: C57.1 IC14.20(CPOUT)
MPU_REGOUT: C55.1 IC14.10(REGOUT)
N$3: Q8.1(B) R50.2 R51.1
N$4: LED1.2(ANODE) R41.1
N$22: LED3.2(A) R15.1
N$23: LED4.1(K) U$1.4_TIMEPULSE
N$36: LED4.2(A) R32.1
N$38: R13.2 U$1.14_VCC_RF
N$40: C40.2 L3.1 R13.1
N$41: LED3.1(K) Q8.3(C)
NET_STAT: R50.1 ; also sheet 1
PA08_S0_I2C_SDA [signal]: IC14.24(SDA) R47.1 ; also sheet 1,3
PA09_S0_I2C_SCL [signal]: IC14.23(SCL) R46.1 ; also sheet 1,3
PA27_GRST [signal]: Q2.1 R6.2 ; also sheet 1
PB09 [signal]: R41.2 ; also sheet 1
PB22_S5_TX [signal]: FB2.2 GRX.TP ; also sheet 1
PB23_S5_RX [signal]: FB3.2 GTX.TP ; also sheet 1
UB_GPS_RX [signal]: FB2.1 U$1.3_RXD
UB_GPS_TX [signal]: FB3.1 U$1.2_TXD
Unconnected: IC14.2(NC_1) IC14.3(NC_2) IC14.4(NC_3) IC14.5(NC_4) IC14.6(AUX_DA) IC14.7(AUX_CL) IC14.12(INT) IC14.14(NC_5) IC14.15(NC_6) IC14.16(NC_7) IC14.17(NC_8) IC14.19(RESV_1) IC14.21(RESV_2) IC14.22(RESV_3) IC14.25(THERMAL_PAD) U$1.5_EXTINT U$1.13_LNA_EN(13_LNA_EN/RES) U$1.15_V_ANT/RESERVED(15_RES/V_ANT) U$1.18_SAFEBOOT_N

### Notes on the sheet
- SamD21 LED indicator
- GPS/Positioning
- Motion Processing Unit

## Sheet 6 of 6
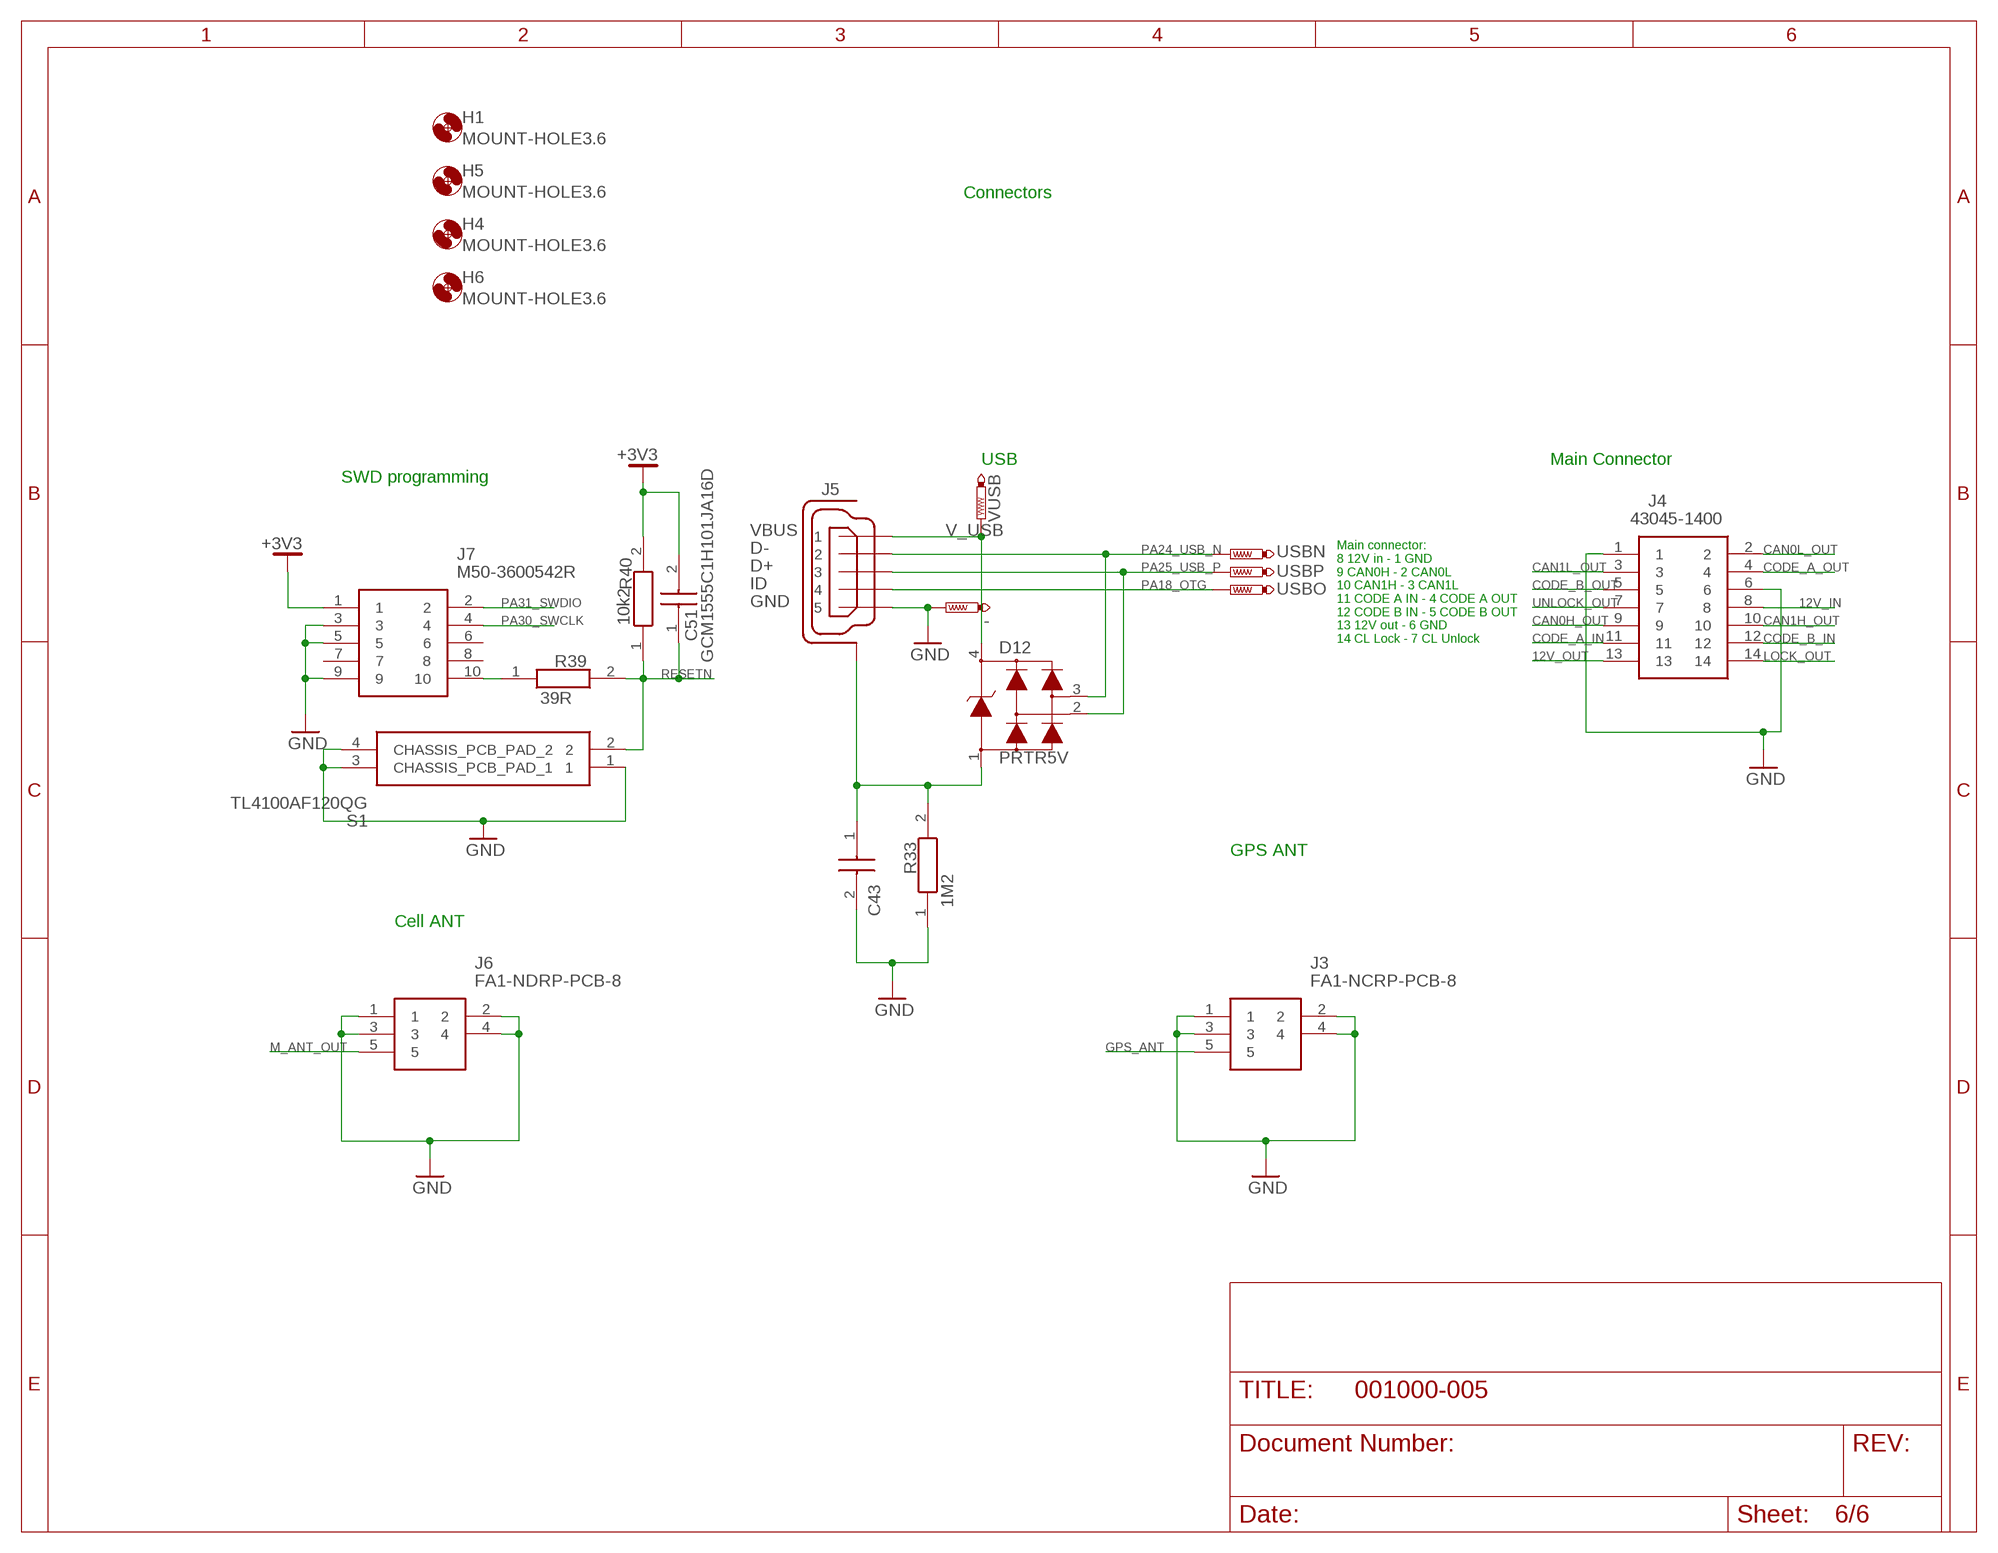
[diagram p5: schematic, sheet 6]

### Parts
-  PTR1TP06R  [TP06R]
C43  4n7  GRM155R71H472KA01J  [CAPC1005X55N]
C51  GCM1555C1H101JA16D  [CAPC1005X55N]
D12  PRTR5V  PRTR5V0U2X,215  [SOT190P230X110-4N]
H1  MOUNT-HOLE3.6  [3,6]
H4  MOUNT-HOLE3.6  [3,6]
H5  MOUNT-HOLE3.6  [3,6]
H6  MOUNT-HOLE3.6  [3,6]
J3  FA1-NCRP-PCB-8  [FA1NCRPPCB8]
J4  43045-1400  [43045-1400]
J5  -  USB-MICRO  [ZX62-AB-5PA]
J6  FA1-NDRP-PCB-8  [FA1NDRPPCB8]
J7  M50-3600542R  [M503600542R]
R33  1M2  CRCW04021M20FKED  [RESC1005X40N]
R39  39R  CRCW040239R0FKEDHP  [RESC1005X40N]
R40  10k2  CRCW040210K2FKED  [RESC1005X40N]
S1  TL4100AF120QG  [TL4100AF120QG]
USBN  PTR1TP06R  [TP06R]
USBO  PTR1TP06R  [TP06R]
USBP  PTR1TP06R  [TP06R]
VUSB  PTR1TP06R  [TP06R]

### Nets
12V_IN: J4.8 ; also sheet 2
12V_OUT: J4.13 ; also sheet 2
+3V3 [pwr/gnd]: C51.2 J7.1 R40.2 ; also sheet 1,2,3,4,5
CAN0H_OUT: J4.9 ; also sheet 4
CAN0L_OUT: J4.2 ; also sheet 4
CAN1H_OUT: J4.10 ; also sheet 4
CAN1L_OUT: J4.3 ; also sheet 4
CODE_A_IN [signal]: J4.11 ; also sheet 3
CODE_A_OUT [signal]: J4.4 ; also sheet 3
CODE_B_IN [signal]: J4.12 ; also sheet 3
CODE_B_OUT [signal]: J4.5 ; also sheet 3
GND [pwr/gnd]: -.TP C43.2 J3.1 J3.2 J3.3 J3.4 J4.1 J4.6 J5.5 J6.1 J6.2 J6.3 J6.4 J7.3 J7.5 J7.9 R33.1 S1.1 S1.3(CHASSIS_PCB_PAD_1) S1.4(CHASSIS_PCB_PAD_2) ; also sheet 1,2,3,4,5
GPS_ANT [ant_wide]: J3.5 ; also sheet 5
LOCK_OUT: J4.14 ; also sheet 3
M_ANT_OUT [ant_wide]: J6.5 ; also sheet 1
N$21: J7.10 R39.1
N$37: C43.1 D12.1 J5.6(SH) J5.7(SH) J5.8(SH) J5.9(SH) J5.10(SH) J5.11(SH) R33.2
PA18_OTG [signal]: J5.4 USBO.TP ; also sheet 1
PA24_USB_N [signal]: D12.3 J5.2 USBN.TP ; also sheet 1
PA25_USB_P [signal]: D12.2 J5.3 USBP.TP ; also sheet 1
PA30_SWCLK [signal]: J7.4 ; also sheet 1
PA31_SWDIO [signal]: J7.2 ; also sheet 1
RESETN: C51.1 R39.2 R40.1 S1.2 ; also sheet 1
UNLOCK_OUT: J4.7 ; also sheet 3
V_USB: D12.4 J5.1 VUSB.TP
Unconnected: J7.6 J7.7 J7.8

### Notes on the sheet
- Connectors
- USB | Main Connector
- SWD programming
- Main connector:
  8 12V in - 1 GND
  9 CAN0H - 2 CAN0L
  10 CAN1H - 3 CAN1L
  11 CODE A IN - 4 CODE A OUT
  12 CODE B IN - 5 CODE B OUT
  13 12V out - 6 GND
  14 CL Lock - 7 CL Unlock
- GPS ANT
- Cell ANT